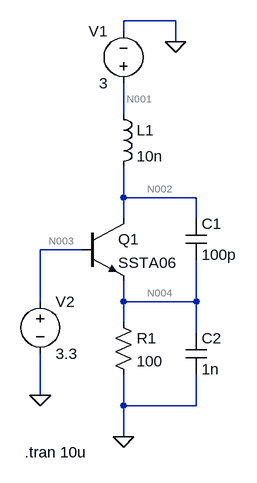
[diagram p0: schematic Draft5.asc]
Draft5.asc, the LTspice schematic file:
Version 4.1
SHEET 1 880 680
WIRE 320 -192 240 -192
WIRE 240 -176 240 -192
WIRE 320 -160 320 -192
WIRE 240 -48 240 -96
WIRE 240 80 240 32
WIRE 352 80 240 80
WIRE 240 112 240 80
WIRE 352 112 352 80
WIRE 176 160 112 160
WIRE 112 240 112 160
WIRE 240 240 240 208
WIRE 352 240 352 176
WIRE 352 240 240 240
WIRE 240 272 240 240
WIRE 352 288 352 240
WIRE 112 384 112 320
WIRE 240 400 240 352
WIRE 352 400 352 352
WIRE 352 400 240 400
WIRE 240 448 240 400
FLAG 320 -160 0
FLAG 240 448 0
FLAG 112 384 0
SYMBOL npn 176 112 R0
SYMATTR InstName Q1
SYMATTR Value SSTA06
SYMBOL ind 224 -64 R0
SYMATTR InstName L1
SYMATTR Value 10n
SYMBOL cap 336 112 R0
SYMATTR InstName C1
SYMATTR Value 100p
SYMBOL cap 336 288 R0
SYMATTR InstName C2
SYMATTR Value 1n
SYMBOL res 224 256 R0
SYMATTR InstName R1
SYMATTR Value 100
SYMBOL voltage 240 -80 R180
WINDOW 0 24 96 Left 2
WINDOW 3 24 16 Left 2
WINDOW 123 0 0 Left 0
WINDOW 39 0 0 Left 0
SYMATTR InstName V1
SYMATTR Value 3
SYMBOL voltage 112 224 R0
WINDOW 123 0 0 Left 0
WINDOW 39 0 0 Left 0
SYMATTR InstName V2
SYMATTR Value 3.3
TEXT 88 472 Left 2 !.tran 10u

The netlist it stands for:
* Draft5.asc
Q1 N002 N003 N004 0 SSTA06
L1 N001 N002 10n
C1 N002 N004 100p
C2 N004 0 1n
R1 N004 0 100
V1 N001 0 3
V2 N003 0 3.3
.model NPN NPN
.model PNP PNP
.lib standard.bjt
.tran 10u
.backanno
.end

* Results of the author's LTspice run, read from the files saved beside the schematic
* Operating Point, zero values left out:
*   V(n001) = 3 V
*   V(n002) = 3 V
*   V(n003) = 3.3 V
*   V(n004) = 2.617 V
*   I(L1) = 26.04 mA
*   I(R1) = 26.17 mA
*   I(V1) = -26.04 mA
*   I(V2) = -137.4 µA
*   Ib(Q1) = 137.4 µA
*   Ic(Q1) = 26.04 mA
*   Ie(Q1) = -26.17 mA
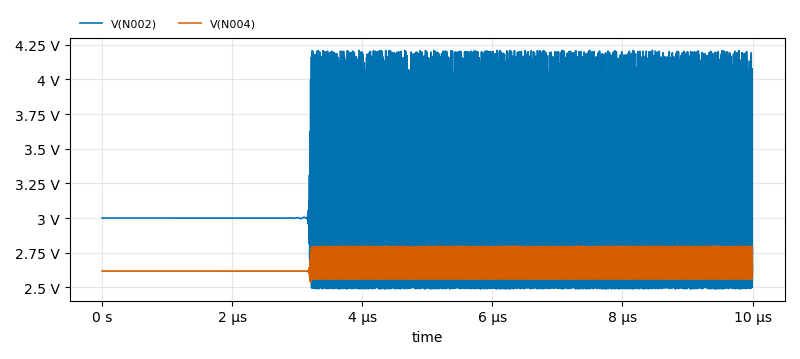
[diagram p1: Transient Analysis of Draft5.asc, plotted from the saved traces]
* Transient Analysis, 1 run:
*   V(N002): min 2.489 V, max 4.211 V, average 3 V, rms 3.032 V, last 2.809 V
*   V(N004): min 2.538 V, max 2.797 V, average 2.648 V, rms 2.649 V, last 2.684 V